# Altium schematic sheet splitterBoard.SchDoc
size A4; Organization: Altium Limited; Address1: L3, 12a Rodborough Rd; Address2: Frenchs Forest; Address3: NSW; Address4: Australia 2086
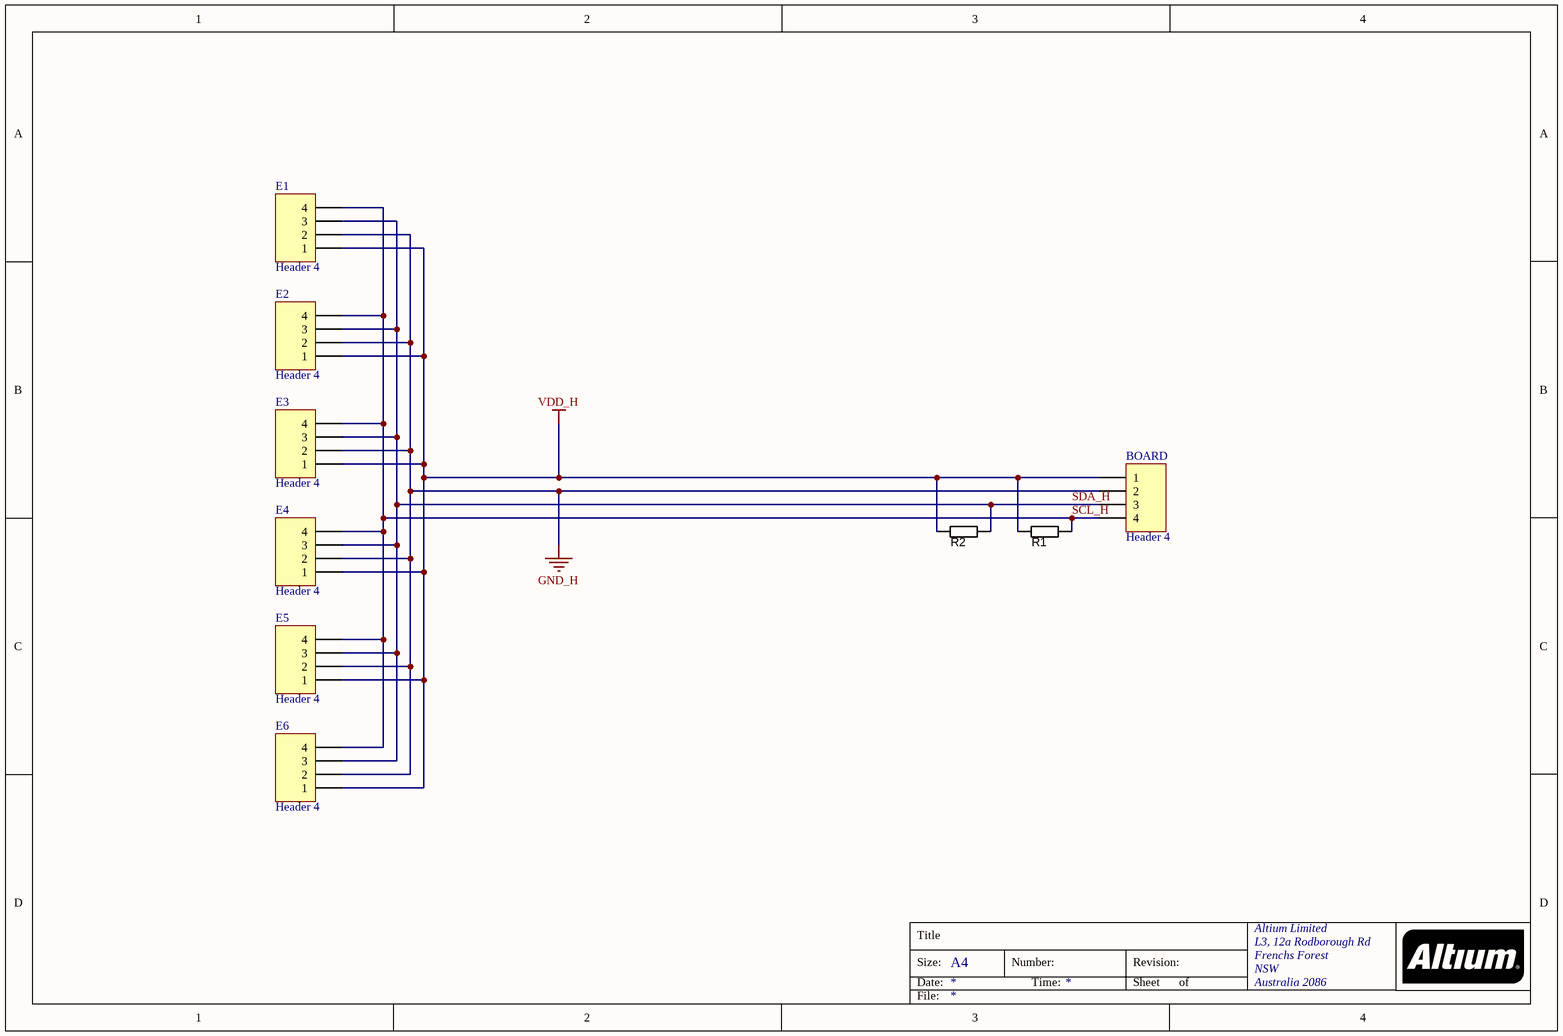
[diagram p0: splitterBoard.SchDoc]

## Parts
BOARD  Header 4  [HDR1X4]
E1  Header 4  [HDR1X4]
E2  Header 4  [HDR1X4]
E3  Header 4  [HDR1X4]
E4  Header 4  [HDR1X4]
E5  Header 4  [HDR1X4]
E6  Header 4  [HDR1X4]
R1  RES_EMPTY_0805  [RESC2012X70N]  (value not drawn)
R2  RES_EMPTY_0805  [RESC2012X70N]  (value not drawn)

## Nets
GND_H: BOARD.2 E1.2 E2.2 E3.2 E4.2 E5.2 E6.2
VDD_H: BOARD.1 E1.1 E2.1 E3.1 E4.1 E5.1 E6.1 R1.1 R2.1
SCL_H: BOARD.4 E1.4 E2.4 E3.4 E4.4 E5.4 E6.4 R1.2
SDA_H: BOARD.3 E1.3 E2.3 E3.3 E4.3 E5.3 E6.3 R2.2

## Notes on the sheet
- Title
- Size:
- Date:
- A4
- Number:
- Time:
- Revision:
- Sheet
- of
- File:

## Library data of the parts
BOARD E1-E6 = Header 4: Header, 4-Pin; LatestRevisionDate: 17-Jul-2002; LatestRevisionNote: Re-released for DXP Platform.; Publisher: Altium Limited
R1 R2 = RES_EMPTY_0805: Resistor, 0805 SMD, Empty footprint; Value: N/A; Package / Case: 0805 (2012 metric)